# Altium schematic sheet Connecteurs.SchDoc: CONNECTEURS GROVE ET MIKROBUS
size A4; DrawnBy: TORIBIO ALEXIS  ALBOUY THOMAS; Address4: 5; DocumentNumber: 5/6; Revision: V5.0 REV.A; SheetNumber: 5; SheetTotal: 6
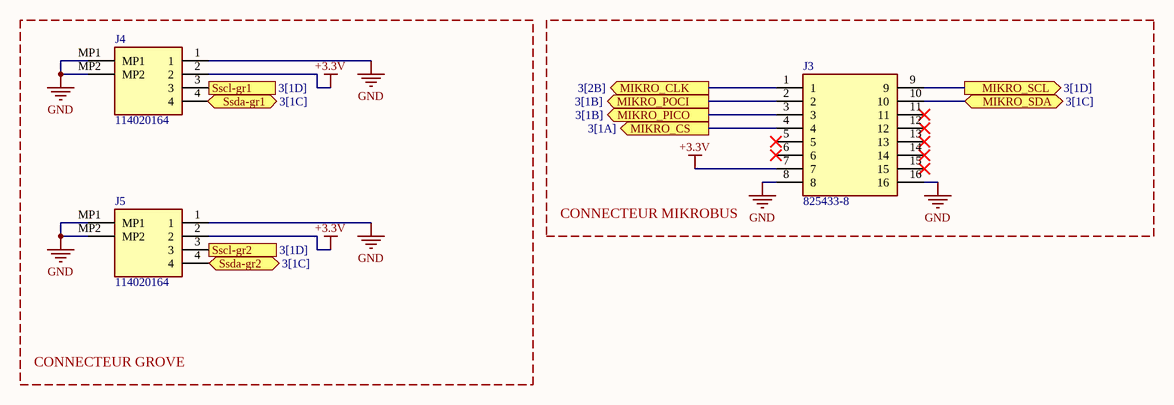
[diagram p0: Connecteurs.SchDoc]

## Parts
J3  825433-8
J4  114020164  [114020164]
J5  114020164  [114020164]

## Blocks framed on the sheet
CONNECTEUR GROVE: J4 J5
CONNECTEUR MIKROBUS: J3

## Ports
MIKRO_CLK (out, see 3[2B]), MIKRO_CS (out, see 3[1A]), MIKRO_PICO (out, see 3[1B]), MIKRO_POCI (out, see 3[1B]), MIKRO_SCL (out, see 3[1D]), MIKRO_SDA (bidir, see 3[1C]), Sscl-gr1 (out, see 3[1D]), Sscl-gr2 (in, see 3[1D]), Ssda-gr1 (bidir, see 3[1C]), Ssda-gr2 (bidir, see 3[1C])

## Nets
+3.3V: J3.7 J4.2 J5.2
GND: J3.8 J3.16 J4.1 J4.MP1 J4.MP2 J5.1 J5.MP1 J5.MP2
MIKRO_CLK: J3.1 ; port MIKRO_CLK
MIKRO_CS: J3.4 ; port MIKRO_CS
MIKRO_PICO: J3.3 ; port MIKRO_PICO
MIKRO_POCI: J3.2 ; port MIKRO_POCI
MIKRO_SCL: J3.9 ; port MIKRO_SCL
MIKRO_SDA: J3.10 ; port MIKRO_SDA
Sscl-gr1: J4.3 ; port Sscl-gr1
Sscl-gr2: J5.3 ; port Sscl-gr2
Ssda-gr2: J5.4 ; port Ssda-gr2

Not connected (* = marked no-connect by the designer): J3 5* 6* 11* 12* 13* 14* 15*; J4 4

## Library data of the parts
J3 = Connect-Mikronus: Headers & Wire Housings 8P double for connection mikrobus; Manufacturer_Name: TE Connectivity; Manufacturer_Part_Number: 825433-8; Mouser Part Number: 571-825433-8
J4 J5 = 114020164: Seeed Studio Accessories Grove Female Header - SMD-4P-2.0mm-90D-20Pcs; Manufacturer_Name: Seeed Studio; Manufacturer_Part_Number: 114020164; Mouser Part Number: 713-114020164